# Altium project Altium101.PrjPcb (part 1 of 2)
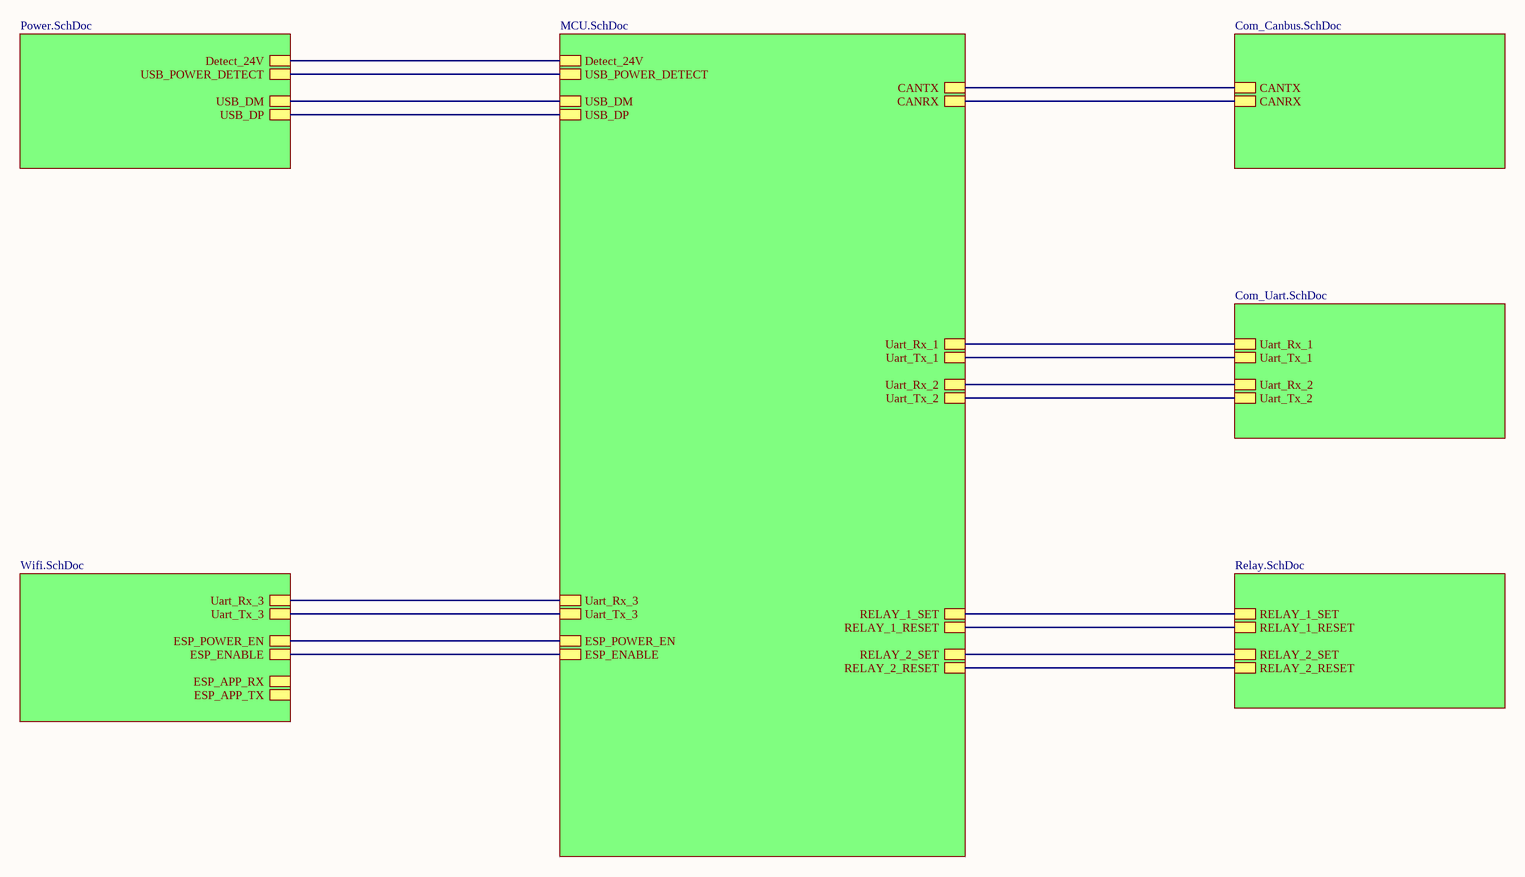
[diagram p0: Main.SchDoc]
7 sheets, 116 parts. Net scope: hierarchical (ports join the sheet entries above them; power ports are global).
Board file: Altium101.PcbDoc
Sheets:
  Main.SchDoc
    MCU = MCU.SchDoc
    Canbus = Com_Canbus.SchDoc
    Uart = Com_Uart.SchDoc
    Relay = Relay.SchDoc
    Wifi = Wifi.SchDoc
    Power = Power.SchDoc

## Sheet Main.SchDoc
size A3; CompanyName: Ok's Lab; Engineer: Oktay Topcu; SheetNumber: 1; SheetTotal: 7; UniqueID: 20200803; X1: Altium101.PrjPcb; X2: A3; X3: 20200803; X4: r1.0; X6: 1; X7: 7; X8: Main.SchDoc

### Sub-sheets
Canbus = Com_Canbus.SchDoc: CANTX, CANRX
MCU = MCU.SchDoc: RELAY_1_SET, RELAY_2_SET, RELAY_2_RESET, RELAY_1_RESET, Uart_Rx_1, Uart_Tx_1, Uart_Rx_2, Uart_Tx_2, Detect_24V, USB_DM, USB_DP, Uart_Rx_3, Uart_Tx_3, ESP_POWER_EN, ESP_ENABLE, CANRX, CANTX, USB_POWER_DETECT
Power = Power.SchDoc: Detect_24V, USB_DM, USB_DP, USB_POWER_DETECT
Relay = Relay.SchDoc: RELAY_1_RESET, RELAY_2_SET, RELAY_1_SET, RELAY_2_RESET
Uart = Com_Uart.SchDoc: Uart_Rx_1, Uart_Tx_1, Uart_Rx_2, Uart_Tx_2
Wifi = Wifi.SchDoc: Uart_Tx_3, Uart_Rx_3, ESP_POWER_EN, ESP_ENABLE, ESP_APP_RX, ESP_APP_TX

### Nets
CANRX: sheet MCU/CANRX, sheet Canbus/CANRX
CANTX: sheet MCU/CANTX, sheet Canbus/CANTX
Detect_24V: sheet MCU/Detect_24V, sheet Power/Detect_24V
ESP_ENABLE: sheet MCU/ESP_ENABLE, sheet Wifi/ESP_ENABLE
ESP_POWER_EN: sheet MCU/ESP_POWER_EN, sheet Wifi/ESP_POWER_EN
RELAY_1_RESET: sheet MCU/RELAY_1_RESET, sheet Relay/RELAY_1_RESET
RELAY_1_SET: sheet MCU/RELAY_1_SET, sheet Relay/RELAY_1_SET
RELAY_2_RESET: sheet MCU/RELAY_2_RESET, sheet Relay/RELAY_2_RESET
RELAY_2_SET: sheet MCU/RELAY_2_SET, sheet Relay/RELAY_2_SET
Uart_Rx_1: sheet MCU/Uart_Rx_1, sheet Uart/Uart_Rx_1
Uart_Rx_2: sheet MCU/Uart_Rx_2, sheet Uart/Uart_Rx_2
Uart_Rx_3: sheet MCU/Uart_Rx_3, sheet Wifi/Uart_Rx_3
Uart_Tx_1: sheet MCU/Uart_Tx_1, sheet Uart/Uart_Tx_1
Uart_Tx_2: sheet MCU/Uart_Tx_2, sheet Uart/Uart_Tx_2
Uart_Tx_3: sheet MCU/Uart_Tx_3, sheet Wifi/Uart_Tx_3
USB_DM: sheet MCU/USB_DM, sheet Power/USB_DM
USB_DP: sheet MCU/USB_DP, sheet Power/USB_DP
USB_POWER_DETECT: sheet MCU/USB_POWER_DETECT, sheet Power/USB_POWER_DETECT

### Notes on the sheet
- Title
- Size:
- Date:
- Number:
- Revision:
- Sheet
- of
- File:

## Sheet MCU.SchDoc
size A3; CompanyName: Ok's Lab; Engineer: Oktay Topcu; SheetNumber: 3; SheetTotal: 7; UniqueID: 20200803; X1: Altium101.PrjPcb; X2: A3; X3: 20200803; X4: r1.0; X6: 3; X7: 7; X8: MCU.SchDoc
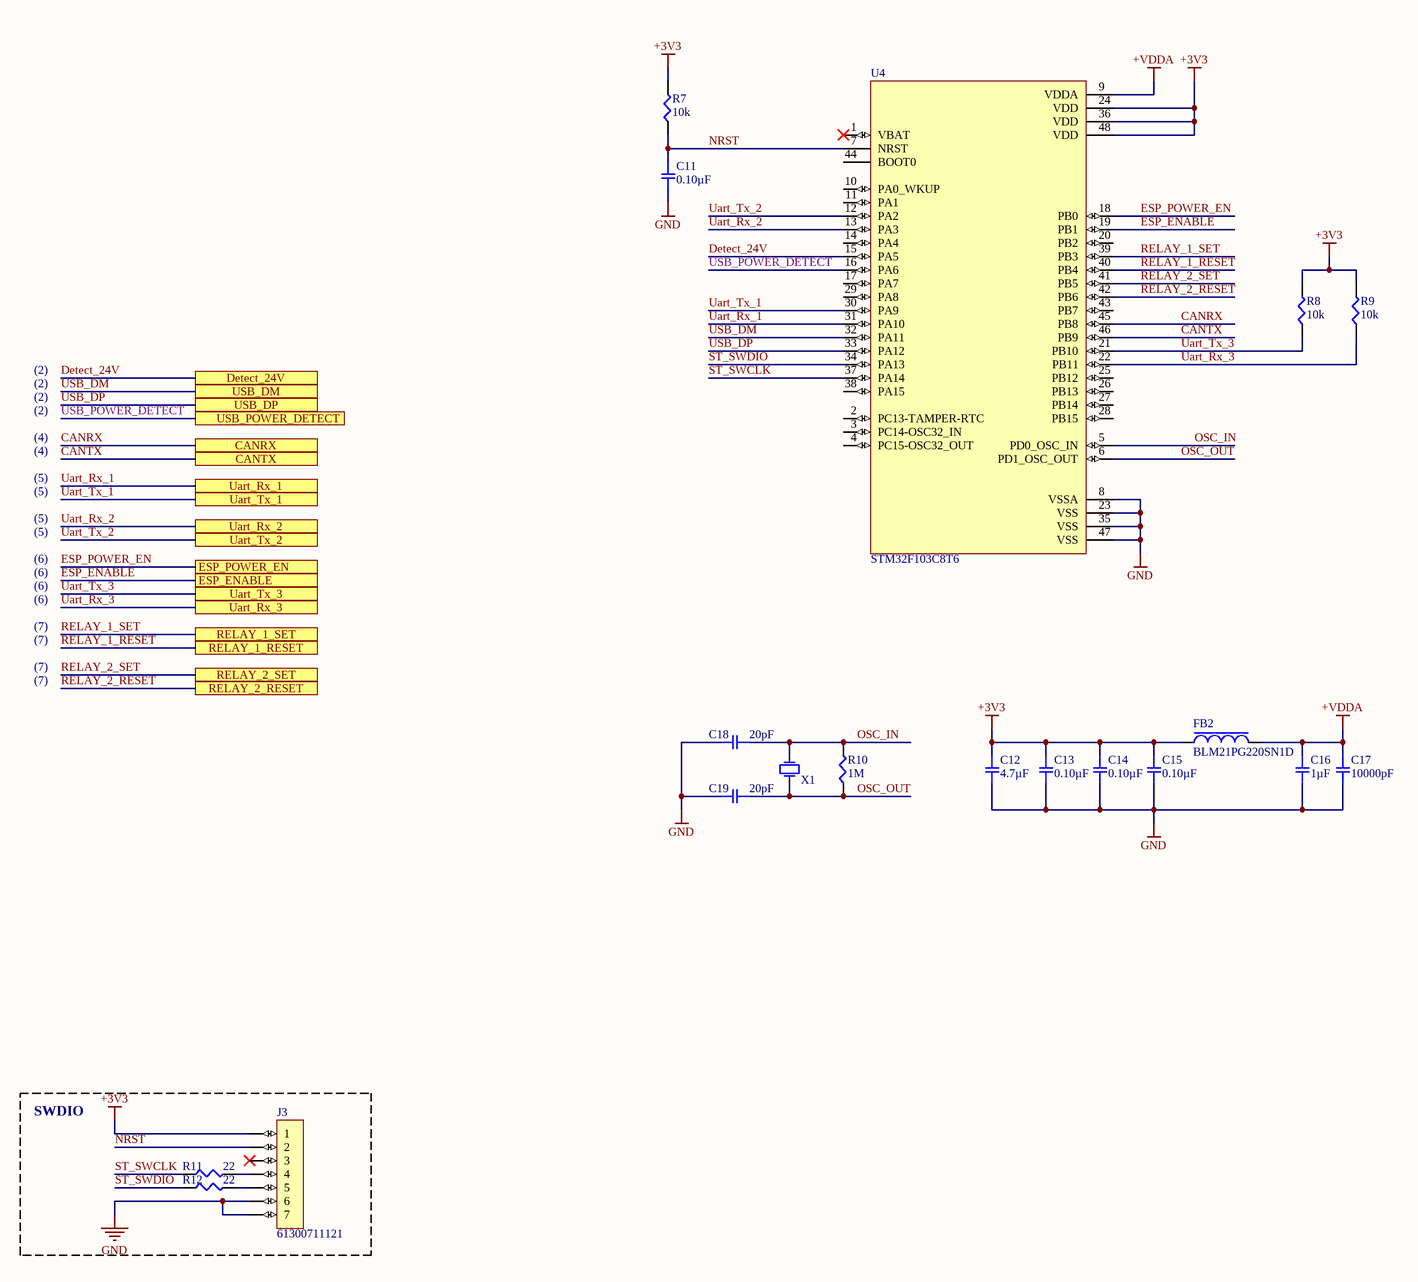
[diagram p1: MCU.SchDoc]

### Parts
C11  0.10µF  [SMD-0603C]
C12  4.7µF  [SMD-0805C]
C13  0.10µF  [SMD-0603C]
C14  0.10µF  [SMD-0603C]
C15  0.10µF  [SMD-0603C]
C16  1µF  [SMD-0603C]
C17  10000pF  [SMD-0603C]
C18  20pF  [SMD-0603C]
C19  20pF  [SMD-0603C]
FB2  BLM21PG220SN1D  [L-0805]
J3  61300711121  [HEADER_7__61300711121]
R7  10k  [SMD-0603-RES]
R8  10k  [SMD-0603-RES]
R9  10k  [SMD-0603-RES]
R10  1M  [SMD-0603-RES]
R11  22  [SMD-0603-RES]
R12  22  [SMD-0603-RES]
U4  STM32F103C8T6  [QFN48-(7mmX7mm)]
X1  EB3250AYA08-8.000M TR  [XTAL_3.2mm_1.5mm_2pad]  (value not drawn)

### Blocks framed on the sheet
SWDIO: J3 R11 R12

### Ports
CANRX, CANTX, Detect_24V, ESP_ENABLE, ESP_POWER_EN, RELAY_1_RESET, RELAY_1_SET, RELAY_2_RESET, RELAY_2_SET, Uart_Rx_1, Uart_Rx_2, Uart_Rx_3, Uart_Tx_1, Uart_Tx_2, Uart_Tx_3, USB_DM, USB_DP, USB_POWER_DETECT

### Nets
+3V3: C12.1 C13.1 C14.1 C15.1 FB2.1 J3.1 R7.2 R8.2 R9.2 U4.24(VDD) U4.36(VDD) U4.48(VDD)
+VDDA: C16.1 C17.1 FB2.2 U4.9(VDDA)
GND: C11.2 C12.2 C13.2 C14.2 C15.2 C16.2 C17.2 C18.2 C19.2 J3.6 J3.7 U4.8(VSSA) U4.23(VSS) U4.35(VSS) U4.47(VSS)
CANRX: U4.45(PB8) ; port CANRX
CANTX: U4.46(PB9) ; port CANTX
Detect_24V: U4.15(PA5) ; port Detect_24V
ESP_ENABLE: U4.19(PB1) ; port ESP_ENABLE
ESP_POWER_EN: U4.18(PB0) ; port ESP_POWER_EN
NRST: C11.1 J3.2 R7.1 U4.7(NRST)
OSC_IN: C18.1 R10.2 U4.5(PD0_OSC_IN) X1.2(OSC2)
OSC_OUT: C19.1 R10.1 U4.6(PD1_OSC_OUT) X1.1(OSC1)
RELAY_1_RESET: U4.40(PB4) ; port RELAY_1_RESET
RELAY_1_SET: U4.39(PB3) ; port RELAY_1_SET
RELAY_2_RESET: U4.42(PB6) ; port RELAY_2_RESET
RELAY_2_SET: U4.41(PB5) ; port RELAY_2_SET
ST_SWCLK: R11.1 U4.37(PA14)
ST_SWDIO: R12.1 U4.34(PA13)
Uart_Rx_1: U4.31(PA10) ; port Uart_Rx_1
Uart_Rx_2: U4.13(PA3) ; port Uart_Rx_2
Uart_Rx_3: R9.1 U4.22(PB11) ; port Uart_Rx_3
Uart_Tx_1: U4.30(PA9) ; port Uart_Tx_1
Uart_Tx_2: U4.12(PA2) ; port Uart_Tx_2
Uart_Tx_3: R8.1 U4.21(PB10) ; port Uart_Tx_3
USB_DM: U4.32(PA11) ; port USB_DM
USB_DP: U4.33(PA12) ; port USB_DP
USB_POWER_DETECT: U4.16(PA6) ; port USB_POWER_DETECT
NetJ3_4: J3.4 R11.2
NetJ3_5: J3.5 R12.2

Not connected (* = marked no-connect by the designer): J3 3*; U4 1(VBAT)* 2(PC13-TAMPER-RTC) 3(PC14-OSC32_IN) 4(PC15-OSC32_OUT) 10(PA0_WKUP) 11(PA1) 14(PA4) 17(PA7) 20(PB2) 25(PB12) 26(PB13) 27(PB14) 28(PB15) 29(PA8) 38(PA15) 43(PB7) 44(BOOT0)

### Notes on the sheet
- (2)
- (4)
- (5)
- (6)
- (7)
- Title
- Size:
- Date:
- Number:
- Revision:
- Sheet
- of
- File:

### Library data of the parts
C11 C13-C15 = GCJ188R71H104KA12D: CAP CER 0.1UF 50V X7R 0603; Manufacturer: Murata Electronics North America; Factory Stock: 0; Unit Price (USD): 0.12; Minimum Quantity: 1; Tolerance: ±10%; Datasheets: http://www.murata.com/~/media/webrenewal/support/library/catalog/products/capacitor/mlcc/c03e.ashx; Image: //media.digikey.com/Renders/Murata%20Renders/0603%28LQG18%29.jpg; Digi-Key Part Number: 490-5798-1-ND; Part Number: GCJ188R71H104KA12D; Quantity Available: 163695; @ qty: 0; Packaging: Cut Tape (CT); Series: GCJ; Part Status: Active; Value: 0.10µF; Voltage: 50V; Temperature Coefficient: X7R; Operating Temperature: -55°C ~ 125°C; Features: Soft Termination; Ratings: AEC-Q200; Applications: Automotive, Boardflex Sensitive; Mounting Type: Surface Mount, MLCC; Package / Case: 0603 (1608 Metric); Size / Dimension: 0.063" L x 0.031" W (1.60mm x 0.80mm); Height - Seated (Max): -; Thickness (Max): 0.035" (0.90mm); Lead Spacing: -; Lead Style: -
C12 = GCJ21BR71C475KA01L: CAP CER 4.7UF 16V X7R 0805; Manufacturer: Murata Electronics North America; Factory Stock: 0; Unit Price (USD): 0.44; Minimum Quantity: 1; Tolerance: ±10%; Datasheets: http://www.murata.com/~/media/webrenewal/support/library/catalog/products/capacitor/mlcc/c03e.ashx; Image: //media.digikey.com/Renders/Murata%20Renders/0805%20(2012%20Metric)%20.85mm.jpg; Digi-Key Part Number: 490-10557-1-ND; Part Number: GCJ21BR71C475KA01L; Quantity Available: 53217; @ qty: 0; Packaging: Cut Tape (CT); Series: GCJ; Part Status: Active; Value: 4.7µF; Voltage: 16V; Temperature Coefficient: X7R; Operating Temperature: -55°C ~ 125°C; Features: Soft Termination; Ratings: AEC-Q200; Applications: Automotive, Boardflex Sensitive; Mounting Type: Surface Mount, MLCC; Package / Case: 0805 (2012 Metric); Size / Dimension: 0.079" L x 0.049" W (2.00mm x 1.25mm); Height - Seated (Max): -; Thickness (Max): 0.057" (1.45mm); Lead Spacing: -; Lead Style: -
C16 = GCM188R71C105KA64D: CAP CER 1UF 16V X7R 0603; Manufacturer: Murata Electronics North America; Factory Stock: 0; Unit Price (USD): 0.24; Minimum Quantity: 1; Tolerance: ±10%; Datasheets: http://www.murata.com/~/media/webrenewal/support/library/catalog/products/capacitor/mlcc/c03e.ashx; Image: //media.digikey.com/Renders/Murata%20Renders/0603%28GCM188%29.jpg; Digi-Key Part Number: 490-5241-1-ND; Part Number: GCM188R71C105KA64D; Quantity Available: 9243; @ qty: 0; Packaging: Cut Tape (CT); Series: GCM; Part Status: Active; Value: 1µF; Voltage: 16V; Temperature Coefficient: X7R; Operating Temperature: -55°C ~ 125°C; Features: -; Ratings: AEC-Q200; Applications: Automotive; Mounting Type: Surface Mount, MLCC; Package / Case: 0603 (1608 Metric); Size / Dimension: 0.063" L x 0.031" W (1.60mm x 0.80mm); Height - Seated (Max): -; Thickness (Max): 0.035" (0.90mm); Lead Spacing: -; Lead Style: -
C17 = GRM188R71C103KA01D: CAP CER 10000PF 16V X7R 0603; Manufacturer: Murata Electronics North America; Factory Stock: 0; Unit Price (USD): 0.1; Minimum Quantity: 1; Tolerance: ±10%; Datasheets: http://www.murata.com/~/media/webrenewal/support/library/catalog/products/capacitor/mlcc/c02e.pdf; Image: //media.digikey.com/Renders/Murata%20Renders/ZRB-SERIES-0402.jpg; Digi-Key Part Number: 490-1525-1-ND; Part Number: GRM188R71C103KA01D; Quantity Available: 178769; @ qty: 0; Packaging: Cut Tape (CT); Series: GRM; Part Status: Active; Value: 10000pF; Voltage: 16V; Temperature Coefficient: X7R; Operating Temperature: -55°C ~ 125°C; Features: -; Ratings: -; Applications: General Purpose; Mounting Type: Surface Mount, MLCC; Package / Case: 0603 (1608 Metric); Size / Dimension: 0.063" L x 0.031" W (1.60mm x 0.80mm); Height - Seated (Max): -; Thickness (Max): 0.035" (0.90mm); Lead Spacing: -; Lead Style: -
C18 C19 = GCM1885C1H200JA16D: CAP CER 20PF 50V NP0 0603; Manufacturer: Murata Electronics North America; Factory Stock: 0; Unit Price (USD): 0.11; Minimum Quantity: 1; Tolerance: ±5%; Temperature Coefficient: C0G, NP0; Datasheets: http://www.murata.com/~/media/webrenewal/support/library/catalog/products/capacitor/mlcc/c03e.ashx; Image: //media.digikey.com/Renders/Murata%20Renders/0603%28GCM188%29.jpg; Digi-Key Part Number: 490-13299-1-ND; Part Number: GCM1885C1H200JA16D; Quantity Available: 4211; @ qty: 0; Packaging: Cut Tape (CT); Series: GCM; Part Status: Active; Value: 20pF; Voltage: 50V; Operating Temperature: -55°C ~ 125°C; Features: -; Ratings: AEC-Q200; Applications: Automotive; Mounting Type: Surface Mount, MLCC; Package / Case: 0603 (1608 Metric); Size / Dimension: 0.063" L x 0.031" W (1.60mm x 0.80mm); Height - Seated (Max): -; Thickness (Max): 0.035" (0.90mm); Lead Spacing: -; Lead Style: -
FB2 = Ferrite_Bead__BLM21PG220SN1D: FERRITE BEAD 22 OHM 0805 1LN; Manufacturer: Murata; Manufacturer Series: BLM21P; Material: Steel,Ferrite; Impedance: 22R; DC Resistance (DCR): 9mR; Tolerance: 25%; Current Rating: 6A; Shielding: Unshielded; Number of Circuits: 1; Resistance: 10mR; Test Frequency: 100MHz; Supplier 1: Avnet; Manufacturer Part Number: BLM21PG220SN1D; Stock 1: 0; Pricing 1: 4000=0.0273, 8000=0.0267, 16000=0.0263, 24000=0.0256, 32000=0.025 (USD); Case/Package: 0805; Number of Pins: 2; Core Material: Ferrite; Case Code (Metric): 2012; Case Code (Imperial): 0805; Weight: 0.000194oz; Terminal Finish: Tin; Min Operating Temperature: -55°C; Max Operating Temperature: 125°C; Packaging: Tape and Reel; Max DC Current: 6A; Number of Lines: 1; Series: BLM21P; Package Quantity: 1; Max Current Rating: 6A; Termination: SMD/SMT; DC Current: 6A; DC Resistance-Max: 9mR; Number of Functions: 1; Length: 2mm; Width: 1.25mm; Height: 0.85mm; Depth: 1.25mm; Radiation Hardening: No; REACH SVHC: No SVHC; Lead Free: Lead Free; RoHS Compliant: Yes; ComponentLink1URL: http://www.murata.com/products/catalog/pdf/c31e.pdf?src-supplier=Element14; ComponentLink1Description: http://www.murata.com/products/catalog/pdf/c31e.pdf?src-supplier=Element14; ComponentLink2URL: http://www.murata.com/products/catalog/pdf/c31e.pdf?src-supplier=Distrelec; ComponentLink2Description: http://www.murata.com/products/catalog/pdf/c31e.pdf?src-supplier=Distrelec; ComponentLink3URL: http://www.jameco.com/Jameco/Products/ProdDS/1845312.pdf?src-supplier=Jameco; ComponentLink3Description: http://www.jameco.com/Jameco/Products/ProdDS/1845312.pdf?src-supplier=Jameco; ComponentLink4URL: https://www.murata.com/en-us/products/productdata/8796738977822/ENFA0005.pdf?src-supplier=Digi-Key; ComponentLink4Description: https://www.murata.com/en-us/products/productdata/8796738977822/ENFA0005.pdf?src-supplier=Digi-Key; ComponentLink5URL: http://uk.rs-online.com/webdocs/13ec/0900766b813ecf58.pdf?src-supplier=RSComponents; ComponentLink5Description: http://uk.rs-online.com/webdocs/13ec/0900766b813ecf58.pdf?src-supplier=RSComponents; ComponentLink6URL: http://www.murata.com/products/catalog/pdf/c31e.pdf?src-supplier=Avnet; ComponentLink6Description: http://www.murata.com/products/catalog/pdf/c31e.pdf?src-supplier=Avnet; ComponentLink7URL: http://search.murata.co.jp/Ceramy/image/img/PDF/ENG/L0110S0100BLM21P.pdf?src-supplier=Future+Electronics; ComponentLink7Description: http://search.murata.co.jp/Ceramy/image/img/PDF/ENG/L0110S0100BLM21P.pdf?src-supplier=Future+Electronics; ComponentLink8URL: http://www.produktinfo.conrad.com/datenblaetter/1100000-1199999/001171738-da-01-en-CHIP_DROSSEL0805_22R0_6000MA_2_0X1_25MM.pdf?src-supplier=Conrad; ComponentLink8Description: http://www.produktinfo.conrad.com/datenblaetter/1100000-1199999/001171738-da-01-en-CHIP_DROSSEL0805_22R0_6000MA_2_0X1_25MM.pdf?src-supplier=Conrad; Supplier Part Number 1: BLM21PG220SN1D
J3 = HEADER_7__61300711121: CONN HEADER 7 POS 2.54; Manufacturer: Wurth Electronics Inc.; Current Rating: 3A; Voltage Rating: 250V; Material Flammability Rating: UL94 V-0; Style: Board to Board or Cable; Number of Positions Loaded: All; Overall Contact Length: 0.454" (11.54mm); Number of Positions: 7; Contact Length - Mating: 0.236" (6.00mm); Contact Length - Post: 0.118" (3.00mm); Shrouding: Unshrouded; Pitch - Mating: 0.100" (2.54mm); Contact Shape: Square; Insulation Height: 0.100" (2.54mm); Insulation Color: Black; Contact Finish Thickness - Mating: -; Operating Temperature: -40°C ~ 125°C; Contact Material: Copper Alloy; Features: -; Ingress Protection: -; Contact Finish - Post: -; Mated Stacking Heights: -; Contact Finish - Mating: Gold; Applications: -; Contact Finish Thickness - Post: -; Insulation Material: Polybutylene Terephthalate (PBT); Manufacturer Part Number: 61300711121; Fastening Type: Push-Pull; Supplier: Digi-Key; Category: Connectors, Interconnects; Mounting Type: Through Hole; Row Spacing - Mating: -; Connector Type: Header; Number of Rows: 1; Termination: Solder; RoHS: RoHS Compliant; Packaging: Bulk; Contact Type: Male Pin; Part Status: Active; ComponentLink1URL: http://katalog.we-online.de/em/datasheet/6130xx11121.pdf; ComponentLink1Description: http://katalog.we-online.de/em/datasheet/6130xx11121.pdf; Pricing: 1=0.37, 10=0.315, 25=0.2632, 50=0.219, 100=0.199, 1000=0.181 (USD); Supplier Part Number: 732-5320-ND
R7 = ERJ-3GEYJ103V: RES SMD 10K OHM 5% 1/10W 0603; Manufacturer: Panasonic Electronic Components; Factory Stock: 0; Unit Price (USD): 0.00321; @ qty: 1500; Minimum Quantity: 1; Power (Watts): 0.1W, 1/10W; Temperature Coefficient: ±200ppm/°C; Part Number: ERJ-3GEYJ103V; Datasheets: http://industrial.panasonic.com/www-cgi/jvcr13pz.cgi?E+PZ+3+AOA0001+ERJ3GEYJ103V+7+WW; Image: //media.digikey.com/Photos/Panasonic%20Photos/MFG_ERJ-P6W%20Series.jpg; Digi-Key Part Number: P10KGCT-ND; Quantity Available: 7178118; Packaging: Cut Tape (CT); Series: ERJ; Part Status: Active; Value: 10k; Tolerance: ±5%; Composition: Thick Film; Features: Automotive AEC-Q200; Operating Temperature: -55°C ~ 155°C; Package / Case: 0603 (1608 Metric); Supplier Device Package: 0603; Size / Dimension: 0.063" L x 0.031" W (1.60mm x 0.80mm); Height - Seated (Max): 0.022" (0.55mm); Number of Terminations: 2; Failure Rate: -
R8 R9 = ERJ-3EKF1002V: RES SMD 10K OHM 1% 1/10W 0603; Manufacturer: Panasonic Electronic Components; Factory Stock: 0; Unit Price (USD): 0.00379; @ qty: 1500; Minimum Quantity: 1; Power (Watts): 0.1W, 1/10W; Temperature Coefficient: ±100ppm/°C; Part Number: ERJ-3EKF1002V; Datasheets: http://industrial.panasonic.com/www-cgi/jvcr13pz.cgi?E+PZ+3+AOA0002+ERJ3EKF1002V+7+WW; Image: //media.digikey.com/Photos/Panasonic%20Photos/MFG_ERJ-P6W%20Series.jpg; Digi-Key Part Number: P10.0KHCT-ND; Quantity Available: 6703141; Packaging: Cut Tape (CT); Series: ERJ; Part Status: Active; Value: 10k; Tolerance: ±1%; Composition: Thick Film; Features: Automotive AEC-Q200; Operating Temperature: -55°C ~ 155°C; Package / Case: 0603 (1608 Metric); Supplier Device Package: 0603; Size / Dimension: 0.063" L x 0.031" W (1.60mm x 0.80mm); Height - Seated (Max): 0.022" (0.55mm); Number of Terminations: 2; Failure Rate: -
R10 = ERJ-3GEYJ105V: RES SMD 1M OHM 5% 1/10W 0603; Manufacturer: Panasonic Electronic Components; Factory Stock: 0; Unit Price (USD): 0.00321; @ qty: 1500; Minimum Quantity: 1; Power (Watts): 0.1W, 1/10W; Temperature Coefficient: ±200ppm/°C; Part Number: ERJ-3GEYJ105V; Datasheets: http://industrial.panasonic.com/www-cgi/jvcr13pz.cgi?E+PZ+3+AOA0001+ERJ3GEYJ105V+7+WW; Image: //media.digikey.com/Photos/Panasonic%20Photos/MFG_ERJ-P6W%20Series.jpg; Digi-Key Part Number: P1.0MGCT-ND; Quantity Available: 250051; Packaging: Cut Tape (CT); Series: ERJ; Part Status: Active; Value: 1M; Tolerance: ±5%; Composition: Thick Film; Features: Automotive AEC-Q200; Operating Temperature: -55°C ~ 155°C; Package / Case: 0603 (1608 Metric); Supplier Device Package: 0603; Size / Dimension: 0.063" L x 0.031" W (1.60mm x 0.80mm); Height - Seated (Max): 0.022" (0.55mm); Number of Terminations: 2; Failure Rate: -
R11 R12 = ERJ-3EKF22R0V: RES SMD 22 OHM 1% 1/10W 0603; Manufacturer: Panasonic Electronic Components; Factory Stock: 0; Unit Price (USD): 0.00379; @ qty: 1500; Minimum Quantity: 1; Power (Watts): 0.1W, 1/10W; Temperature Coefficient: ±100ppm/°C; Part Number: ERJ-3EKF22R0V; Datasheets: http://industrial.panasonic.com/www-cgi/jvcr13pz.cgi?E+PZ+3+AOA0002+ERJ3EKF22R0V+7+WW; Image: //media.digikey.com/Photos/Panasonic%20Photos/MFG_ERJ-P6W%20Series.jpg; Digi-Key Part Number: P22.0HCT-ND; Quantity Available: 100321; Packaging: Cut Tape (CT); Series: ERJ; Part Status: Active; Value: 22; Tolerance: ±1%; Composition: Thick Film; Features: Automotive AEC-Q200; Operating Temperature: -55°C ~ 155°C; Package / Case: 0603 (1608 Metric); Supplier Device Package: 0603; Size / Dimension: 0.063" L x 0.031" W (1.60mm x 0.80mm); Height - Seated (Max): 0.022" (0.55mm); Number of Terminations: 2; Failure Rate: -
U4 = STM32F103C8T6: IC MCU 32-Bit 72MHz 64kB FLASH LQFP48; MF: STMicroelectronics; RAM Size: 20KB; Max Power Dissipation: 363mW; Interface: I2C,SPI,USB,CAN,IrDA,UART,USART,LIN; Number of I/Os: 37; Number of Timers/Counters: 4; Max Supply Voltage: 3.6V; Number of ADC Channels: 10; Min Supply Voltage: 2V; Oscillator Type: Internal; Number of Programmable I/O: 48; Data Bus Width: 32b; Number of Bits: 32; Watchdog Timer: Yes; Peripherals: POR,PWM,WDT,DMA,Temp Sensor,I2C; Core Architecture: ARM; Number of PWM Channels: 1; Number of SPI Channels: 2; Price: None; Package: LQFP-48 STMicroelectronics; Value: *; MP: STM32F103C8T6; Availability: Unavailable; Supplier 1: Digi-Key; Manufacturer: STMicroelectronics; Manufacturer Part Number: STM32F103C8T6; RoHS: Yes; Category: Microcontrollers; Pricing 1: 1=7,00000, 10=6,28800, 25=5,94440, 80=5,15175, 250=4,88756, 500=4,40320 (USD); Case/Package: LQFP; Number of Pins: 48; Min Operating Temperature: -40°C; Max Operating Temperature: 85°C; Frequency: 72MHz; Packaging: Tray; Package Quantity: 250; Density: 64KB; Memory Type: FLASH; Max Frequency: 72MHz; Memory Size: 64KB; Termination: SMD/SMT; Number of I2C Channels: 2; Address Bus Width: 32b; Length: 7mm; Width: 7.2mm; Height: 1.45mm; Radiation Hardening: No; Lead Free: Lead Free; REACH SVHC: No SVHC; ComponentLink1URL: https://datasheet.ciiva.com/15122/getdatasheetpartid-69880-15122076.pdf?src-supplier=Verical; ComponentLink1Description: https://datasheet.ciiva.com/15122/getdatasheetpartid-69880-15122076.pdf?src-supplier=Verical; ComponentLink2URL: https://datasheet.ciiva.com/26816/stm32f103c8t6-26816902.pdf?src-supplier=IIIC; ComponentLink2Description: https://datasheet.ciiva.com/26816/stm32f103c8t6-26816902.pdf?src-supplier=IIIC; ComponentLink3URL: https://datasheet.ciiva.com/16210/cd00161566-16210248.pdf?src-supplier=Future+Electronics; ComponentLink3Description: https://datasheet.ciiva.com/16210/cd00161566-16210248.pdf?src-supplier=Future+Electronics; ComponentLink4URL: https://datasheet.ciiva.com/14100/pustm-arm-microcont-stm32f103-en-14100508.pdf?src-supplier=Distrelec; ComponentLink4Description: https://datasheet.ciiva.com/14100/pustm-arm-microcont-stm32f103-en-14100508.pdf?src-supplier=Distrelec; ComponentLink5URL: https://datasheet.ciiva.com/8054/1730126-8054942.pdf?src-supplier=Element14; ComponentLink5Description: https://datasheet.ciiva.com/8054/1730126-8054942.pdf?src-supplier=Element14; ComponentLink6URL: https://datasheet.ciiva.com/48687/001075658-da-01-en-mcu-64kb-mem-stm32f103c8t6-lqfp-48-stm-48687589.pdf?src-supplier=Conrad; ComponentLink6Description: https://datasheet.ciiva.com/48687/001075658-da-01-en-mcu-64kb-mem-stm32f103c8t6-lqfp-48-stm-48687589.pdf?src-supplier=Conrad; Supplier Part Number 1: 497-6063-ND
X1 = CRYSTAL__ECS-.327-12.5-34B-TR: Crystal 8MHz 8pF Automotive 2-Pin CSMD T/R; Manufacturer: Ecliptek; Supplier 1: Digi-Key; Supplier Part Number 1: 2773-EB3250AYA08-8.000MCT-ND; Manufacturer Part Number: EB3250AYA08-8.000M TR; RoHS: Yes; Stock 1: 16756; Pricing 1: 1=1,05000, 10=0,92900, 50=0,86860, 100=0,76760, 500=0,72720 (USD); RoHS Compliant: No

## Sheet Com_Canbus.SchDoc
size A3; CompanyName: Ok's Lab; Engineer: Oktay Topcu; SheetNumber: 4; SheetTotal: 7; UniqueID: 20200803; X1: Altium101.PrjPcb; X2: A3; X3: 20200803; X4: r1.0; X6: 4; X7: 7; X8: Com_Canbus.SchDoc
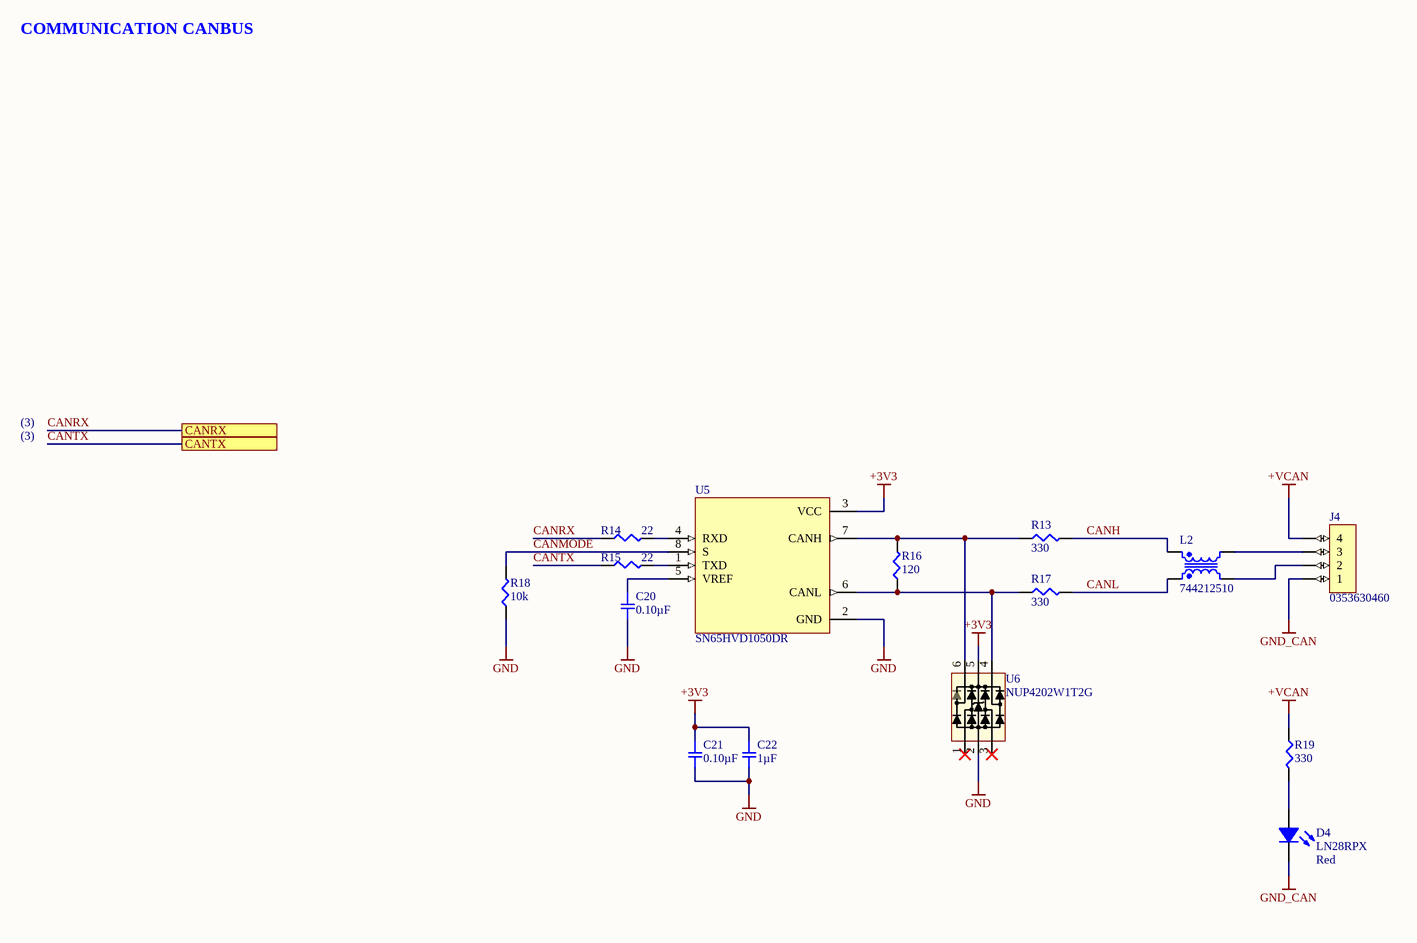
[diagram p2: Com_Canbus.SchDoc]

### Parts
C20  0.10µF  [SMD-0603C]
C21  0.10µF  [SMD-0603C]
C22  1µF  [SMD-0603C]
D4  LN28RPX  Lens Color: Red  [Led-3mm-Red-h7]
J4  0353630460  [CONN_4_POS__0353630460]
L2  744212510  [CM_6.50mm x 3.60mm]
R13  330  [SMD-0603-RES]
R14  22  [SMD-0603-RES]
R15  22  [SMD-0603-RES]
R16  120  [SMD-0603-RES]
R17  330  [SMD-0603-RES]
R18  10k  [SMD-0603-RES]
R19  330  [SMD-0603-RES]
U5  SN65HVD1050DR  [SOIC-8_L]
U6  NUP4202W1T2G  [SOT-363]

### Ports
CANRX, CANTX

### Nets
+3V3: C21.1 C22.1 U5.3(VCC) U6.5
+VCAN: J4.4 R19.1
GND: C20.2 C21.2 C22.2 R18.1 U5.2(GND) U6.2
GND_CAN: D4.2(K) J4.1
CANH: L2.3 R13.2
CANL: L2.1 R17.2
CANMODE: R18.2 U5.8(S)
CANRX: R14.1 ; port CANRX
CANTX: R15.1 ; port CANTX
NetC20_1: C20.1 U5.5(VREF)
NetD4_1: D4.1(A) R19.2
NetJ4_2: J4.2 L2.5
NetJ4_3: J4.3 L2.4
NetR13_1: R13.1 R16.2 U5.7(CANH) U6.6
NetR14_2: R14.2 U5.4(RXD)
NetR15_2: R15.2 U5.1(TXD)
NetR16_1: R16.1 R17.1 U5.6(CANL) U6.4

Not connected (* = marked no-connect by the designer): U6 1* 3*

### Notes on the sheet
- COMMUNICATION CANBUS
- (3)
- Title
- Size:
- Date:
- Number:
- Revision:
- Sheet
- of
- File:

### Library data of the parts
C20 C21 = GCJ188R71H104KA12D: as C11 on sheet MCU; Datasheets: http://www.murata.com/~/media/webrenewal/support/library/catalog/products/capacitor/mlcc/c03e.ashx; Image: //media.digikey.com/Renders/Murata%20Renders/0603%28LQG18%29.jpg; Digi-Key Part Number: 490-5798-1-ND; Part Number: GCJ188R71H104KA12D; Quantity Available: 163695; @ qty: 0; Packaging: Cut Tape (CT); Series: GCJ; Part Status: Active; Value: 0.10µF; Voltage: 50V; Temperature Coefficient: X7R; Operating Temperature: -55°C ~ 125°C; Features: Soft Termination; Ratings: AEC-Q200; Applications: Automotive, Boardflex Sensitive; Mounting Type: Surface Mount, MLCC; Package / Case: 0603 (1608 Metric); Size / Dimension: 0.063" L x 0.031" W (1.60mm x 0.80mm); Height - Seated (Max): -; Thickness (Max): 0.035" (0.90mm); Lead Spacing: -; Lead Style: -
C22 = GCM188R71C105KA64D: as C16 on sheet MCU; Datasheets: http://www.murata.com/~/media/webrenewal/support/library/catalog/products/capacitor/mlcc/c03e.ashx; Image: //media.digikey.com/Renders/Murata%20Renders/0603%28GCM188%29.jpg; Digi-Key Part Number: 490-5241-1-ND; Part Number: GCM188R71C105KA64D; Quantity Available: 9243; @ qty: 0; Packaging: Cut Tape (CT); Series: GCM; Part Status: Active; Value: 1µF; Voltage: 16V; Temperature Coefficient: X7R; Operating Temperature: -55°C ~ 125°C; Features: -; Ratings: AEC-Q200; Applications: Automotive; Mounting Type: Surface Mount, MLCC; Package / Case: 0603 (1608 Metric); Size / Dimension: 0.063" L x 0.031" W (1.60mm x 0.80mm); Height - Seated (Max): -; Thickness (Max): 0.035" (0.90mm); Lead Spacing: -; Lead Style: -
D4 = LED_RED__LN28RPX: LED RED DIFF 3MM ROUND T/H; Manufacturer: Panasonic Electronic Components; Lens Transparency: Diffused; Millicandela Rating: 2.8mcd; Lens Style/Size: Round with Domed Top, 3mm (T-1), 3.00mm; Voltage - Forward (Vf) (Typ): 2.2V; Current - Test: 15mA; Wavelength - Peak: 700nm; Manufacturer Part Number: LN28RPX; Category: Optoelectronics; Supplier: Digi-Key; RoHS: RoHS Compliant; Packaging: Bulk; Part Status: Not For New Designs; Color: Red; Viewing Angle: -; Mounting Type: Through Hole; Wavelength - Dominant: -; Features: -; Package / Case: Radial; Supplier Device Package: 3mm Round; Size / Dimension: -; Height (Max): 5.70mm; ComponentLink1URL: http://industrial.panasonic.com/www-cgi/jvcr13pz.cgi?E+SC+4+ATA7001+LN28RPX+8+WW; ComponentLink1Description: http://industrial.panasonic.com/www-cgi/jvcr13pz.cgi?E+SC+4+ATA7001+LN28RPX+8+WW; Pricing: 1=0.45, 10=0.326, 25=0.2664, 100=0.213, 250=0.17972, 500=0.15308, 1000=0.11981, 2500=0.10982, 5000=0.09984 (USD); Supplier Part Number: P563-ND
J4 = CONN_4_POS__0353630460: CONN HEADER 4POS 2MM R/A TIN; Manufacturer: Molex Connector Corporation; Shrouding: Shrouded - 4 Wall; Style: Board to Cable/Wire; Pitch - Mating: 0.079" (2.00mm); Material Flammability Rating: UL94 V-0; Contact Length - Mating: 0.145" (3.70mm); Contact Length - Post: 0.126" (3.20mm); Number of Positions Loaded: All; Number of Positions: 4; Insulation Color: Natural; Insulation Material: Polyamide (PA), Nylon; Contact Finish Thickness - Mating: 78.7µin (2.00µm); Insulation Height: 0.217" (5.51mm); Overall Contact Length: -; Part Status: Active; Current Rating: -; RoHS: RoHS Compliant; Ingress Protection: -; Contact Material: Brass; Contact Finish - Post: Tin; Termination: Kinked Pin, Solder; Mounting Type: Through Hole, Right Angle; Fastening Type: Locking Ramp; Row Spacing - Mating: -; Mated Stacking Heights: -; Features: -; Contact Shape: Square; Contact Type: Male Pin; Packaging: Bulk; Supplier: Digi-Key; Manufacturer Part Number: 0353630460; Category: Connectors, Interconnects; Contact Finish Thickness - Post: 78.7µin (2.00µm); Voltage Rating: -; Operating Temperature: -; Contact Finish - Mating: Tin; Number of Rows: 1; Connector Type: Header; Applications: Automotive, General Purpose; ComponentLink1URL: http://www.molex.com/pdm_docs/sd/353630460_sd.pdf; ComponentLink1Description: http://www.molex.com/pdm_docs/sd/353630460_sd.pdf; Pricing: 1=0.48, 10=0.455, 100=0.3184, 500=0.27294, 1000=0.22745, 5000=0.19496, 10000=0.18196 (USD); Supplier Part Number: WM18933-ND
L2 = CM__744212510: Common Mode Filters / Chokes WE-SL1 SMD Ln Filter 2x51uH 300ohm; Manufacturer: Wurth Electronics; Core Material: Ferrite; Inductance: 51uH; Number of Lines: 2; DC Resistance (DCR): 160mR; Current Rating: 300mA; Test Frequency: 100kHz; Inductance Tolerance: 50%; Voltage Rating (DC): 80V; Impedance: 300R; Supplier 1: Digi-Key; Manufacturer Part Number: 744212510; RoHS: Yes; Category: Fixed Inductors; Pricing 1: 1=4,37000, 10=4,31200, 50=3,89500, 100=3,75600, 500=3,47800 (USD); Mount: Surface Mount; Case/Package: SMD/SMT; Number of Pins: 4; Min Operating Temperature: -40°C; Max Operating Temperature: 105°C; Package Quantity: 1000; Packaging: Tape and Reel; Current: 300mA; Max DC Current: 300mA; Termination: SMD/SMT; Series: WE-SL1; Tolerance: 50%; Length: 6.5mm; Width: 0.142inch; Height: 1.65mm; Depth: 3.6mm; REACH SVHC: No SVHC; Lead Free: Lead Free; RoHS Compliant: Yes; ComponentLink1URL: https://datasheet.ciiva.com/11800/0900766b8059564e-11800467.pdf?src-supplier=RSComponents; ComponentLink1Description: https://datasheet.ciiva.com/11800/0900766b8059564e-11800467.pdf?src-supplier=RSComponents; ComponentLink2URL: https://datasheet.ciiva.com/6048/1735560-6048484.pdf?src-supplier=Farnell; ComponentLink2Description: https://datasheet.ciiva.com/6048/1735560-6048484.pdf?src-supplier=Farnell; ComponentLink3URL: https://datasheet.ciiva.com/1130/744212510-1130407.pdf?src-supplier=Newark; ComponentLink3Description: https://datasheet.ciiva.com/1130/744212510-1130407.pdf?src-supplier=Newark; ComponentLink4URL: https://datasheet.ciiva.com/4952/744212510-77598-4952687.pdf?src-supplier=Mouser; ComponentLink4Description: https://datasheet.ciiva.com/4952/744212510-77598-4952687.pdf?src-supplier=Mouser; ComponentLink5URL: https://datasheet.ciiva.com/7764/1735560-7764951.pdf?src-supplier=Element14; ComponentLink5Description: https://datasheet.ciiva.com/7764/1735560-7764951.pdf?src-supplier=Element14; ComponentLink6URL: https://datasheet.ciiva.com/6216/744212510-6216346.pdf?src-supplier=Digi-Key; ComponentLink6Description: https://datasheet.ciiva.com/6216/744212510-6216346.pdf?src-supplier=Digi-Key; ComponentLink7URL: https://datasheet.ciiva.com/22705/1735560-22705131.pdf?src-supplier=Element14; ComponentLink7Description: https://datasheet.ciiva.com/22705/1735560-22705131.pdf?src-supplier=Element14; ComponentLink8URL: https://datasheet.ciiva.com/6216/744212510-6216348.pdf?src-supplier=Digi-Key; ComponentLink8Description: https://datasheet.ciiva.com/6216/744212510-6216348.pdf?src-supplier=Digi-Key; Supplier Part Number 1: 732-3941-6-ND
R13 R17 R19 = ERJ-3EKF3300V: RES SMD 330 OHM 1% 1/10W 0603; Manufacturer: Panasonic Electronic Components; Factory Stock: 0; Unit Price (USD): 0.00379; @ qty: 1500; Minimum Quantity: 1; Power (Watts): 0.1W, 1/10W; Temperature Coefficient: ±100ppm/°C; Part Number: ERJ-3EKF3300V; Datasheets: http://industrial.panasonic.com/www-cgi/jvcr13pz.cgi?E+PZ+3+AOA0002+ERJ3EKF3300V+7+WW; Image: //media.digikey.com/Photos/Panasonic%20Photos/MFG_ERJ-P6W%20Series.jpg; Digi-Key Part Number: P330HCT-ND; Quantity Available: 670984; Packaging: Cut Tape (CT); Series: ERJ; Part Status: Active; Value: 330; Tolerance: ±1%; Composition: Thick Film; Features: Automotive AEC-Q200; Operating Temperature: -55°C ~ 155°C; Package / Case: 0603 (1608 Metric); Supplier Device Package: 0603; Size / Dimension: 0.063" L x 0.031" W (1.60mm x 0.80mm); Height - Seated (Max): 0.022" (0.55mm); Number of Terminations: 2; Failure Rate: -
R14 R15 = ERJ-3EKF22R0V: as R11 on sheet MCU; Part Number: ERJ-3EKF22R0V; Datasheets: http://industrial.panasonic.com/www-cgi/jvcr13pz.cgi?E+PZ+3+AOA0002+ERJ3EKF22R0V+7+WW; Image: //media.digikey.com/Photos/Panasonic%20Photos/MFG_ERJ-P6W%20Series.jpg; Digi-Key Part Number: P22.0HCT-ND; Quantity Available: 100321; Packaging: Cut Tape (CT); Series: ERJ; Part Status: Active; Value: 22; Tolerance: ±1%; Composition: Thick Film; Features: Automotive AEC-Q200; Operating Temperature: -55°C ~ 155°C; Package / Case: 0603 (1608 Metric); Supplier Device Package: 0603; Size / Dimension: 0.063" L x 0.031" W (1.60mm x 0.80mm); Height - Seated (Max): 0.022" (0.55mm); Number of Terminations: 2; Failure Rate: -
R16 = ERJ-3EKF1200V: RES SMD 120 OHM 1% 1/10W 0603; Manufacturer: Panasonic Electronic Components; Factory Stock: 0; Unit Price (USD): 0.00379; @ qty: 1500; Minimum Quantity: 1; Power (Watts): 0.1W, 1/10W; Temperature Coefficient: ±100ppm/°C; Part Number: ERJ-3EKF1200V; Datasheets: http://industrial.panasonic.com/www-cgi/jvcr13pz.cgi?E+PZ+3+AOA0002+ERJ3EKF1200V+7+WW; Image: //media.digikey.com/Photos/Panasonic%20Photos/MFG_ERJ-P6W%20Series.jpg; Digi-Key Part Number: P120HCT-ND; Quantity Available: 84623; Packaging: Cut Tape (CT); Series: ERJ; Part Status: Active; Value: 120; Tolerance: ±1%; Composition: Thick Film; Features: Automotive AEC-Q200; Operating Temperature: -55°C ~ 155°C; Package / Case: 0603 (1608 Metric); Supplier Device Package: 0603; Size / Dimension: 0.063" L x 0.031" W (1.60mm x 0.80mm); Height - Seated (Max): 0.022" (0.55mm); Number of Terminations: 2; Failure Rate: -
R18 = ERJ-3EKF1002V: as R8 on sheet MCU; Part Number: ERJ-3EKF1002V; Datasheets: http://industrial.panasonic.com/www-cgi/jvcr13pz.cgi?E+PZ+3+AOA0002+ERJ3EKF1002V+7+WW; Image: //media.digikey.com/Photos/Panasonic%20Photos/MFG_ERJ-P6W%20Series.jpg; Digi-Key Part Number: P10.0KHCT-ND; Quantity Available: 6703141; Packaging: Cut Tape (CT); Series: ERJ; Part Status: Active; Value: 10k; Tolerance: ±1%; Composition: Thick Film; Features: Automotive AEC-Q200; Operating Temperature: -55°C ~ 155°C; Package / Case: 0603 (1608 Metric); Supplier Device Package: 0603; Size / Dimension: 0.063" L x 0.031" W (1.60mm x 0.80mm); Height - Seated (Max): 0.022" (0.55mm); Number of Terminations: 2; Failure Rate: -
U5 = SN65HVD1050DR: High-Speed CAN Transceiver with Silent Mode 8-SOIC -40 to 125; MF: Texas Instruments; Min Supply Voltage: 4.75V; Max Supply Voltage: 5.25V; Data Rate: 1Mbps; Number of Transceivers: 1; Operating Supply Voltage: 5V; Nominal Supply Current: 70mA; Purchase-URL: https://pricing.snapeda.com/search/part/SN65HVD1050DR/?ref=eda; Digi-Key_Part_Number: 296-26335-1-ND; MP: SN65HVD1050DR; Check_prices: https://www.snapeda.com/parts/SN65HVD1050DR/Texas%20Instruments/view-part/1043210/?ref=eda; SnapEDA_Link: https://www.snapeda.com/parts/SN65HVD1050DR/Texas%20Instruments/view-part/1043210/?ref=snap; Value: *; Package: SOIC-8 Texas Instruments; Supplier 1: Digi-Key; Manufacturer: Texas Instruments; Manufacturer Part Number: SN65HVD1050DR; RoHS: Yes; Category: Interface ICs; Pricing 1: 1=1,69000, 10=1,51300, 25=1,43640, 100=1,18000, 250=1,10304, 500=0,97478, 1000=0,84700 (USD); Case/Package: D; Number of Pins: 8; Weight: 0.002677oz; Contact Plating: Gold; Min Operating Temperature: -40°C; Max Operating Temperature: 125°C; Packaging: Tape and Reel; Package Quantity: 2500; Max Supply Current: 70mA; Number of Drivers: 1; Number of Receivers: 1; Series: -; Supply Current: 70mA; Number of Transmit Buffers: 1; Number of Receive Buffers: 1; Radiation Hardening: No; Lead Free: Lead Free; RoHS Compliant: Yes; REACH SVHC: No SVHC; ComponentLink1URL: https://datasheet.ciiva.com/26828/sn65hvd1050dr-26828644.pdf?src-supplier=IIIC; ComponentLink1Description: https://datasheet.ciiva.com/26828/sn65hvd1050dr-26828644.pdf?src-supplier=IIIC; ComponentLink2URL: https://datasheet.ciiva.com/46392/1888948-46392549.pdf?src-supplier=Element14; ComponentLink2Description: https://datasheet.ciiva.com/46392/1888948-46392549.pdf?src-supplier=Element14; ComponentLink3URL: https://datasheet.ciiva.com/1701/sn65hvd1050-1701693.pdf?src-supplier=Digi-Key; ComponentLink3Description: https://datasheet.ciiva.com/1701/sn65hvd1050-1701693.pdf?src-supplier=Digi-Key; ComponentLink4URL: https://datasheet.ciiva.com/1701/sn65hvd1050-1701694.pdf?src-supplier=Digi-Key; ComponentLink4Description: https://datasheet.ciiva.com/1701/sn65hvd1050-1701694.pdf?src-supplier=Digi-Key; ComponentLink5URL: https://datasheet.ciiva.com/1701/sn65hvd1050-1701695.pdf?src-supplier=Digi-Key; ComponentLink5Description: https://datasheet.ciiva.com/1701/sn65hvd1050-1701695.pdf?src-supplier=Digi-Key; Supplier Part Number 1: 296-26335-6-ND
U6 = NUP4202W1T2G: TVS DIODE 5VWM 14.5VC SOT363; Manufacturer: ON Semiconductor; Capacitance @ Frequency: 3pF @ 1MHz; Voltage - Reverse Standoff (Typ): 5V (Max); Voltage - Breakdown (Min): 6V; Power Line Protection: No; Current - Peak Pulse (10/1000µs): 28A (8/20µs); Power - Peak Pulse: 500W; Voltage - Clamping (Max) @ Ipp: 14.5V (Typ); Type: Steering (Rail to Rail); Operating Temperature: -40°C ~ 125°C (TJ); Supplier: Digi-Key; Applications: General Purpose; Manufacturer Part Number: NUP4202W1T2G; Packaging: Cut Tape (CT); Package / Case: 6-TSSOP, SC-88, SOT-363; Mounting Type: Surface Mount; RoHS: RoHS Compliant; Category: Circuit Protection; Supplier Device Package: SC-88/SC70-6/SOT-363; Part Status: Active; ComponentLink1URL: http://www.onsemi.com/pub_link/Collateral/NUP4202W1-D.PDF; ComponentLink1Description: http://www.onsemi.com/pub_link/Collateral/NUP4202W1-D.PDF; Pricing: 1=0.69, 10=0.595, 100=0.4441, 500=0.34896, 1000=0.26965 (USD); Stock: 8683; Supplier Part Number: NUP4202W1T2GOSCT-ND

## Sheet Com_Uart.SchDoc
size A3; CompanyName: Ok's Lab; Engineer: Oktay Topcu; SheetNumber: 5; SheetTotal: 7; UniqueID: 20200803; X1: Altium101.PrjPcb; X2: A3; X3: 20200803; X4: r1.0; X6: 5; X7: 7; X8: Com_Uart.SchDoc
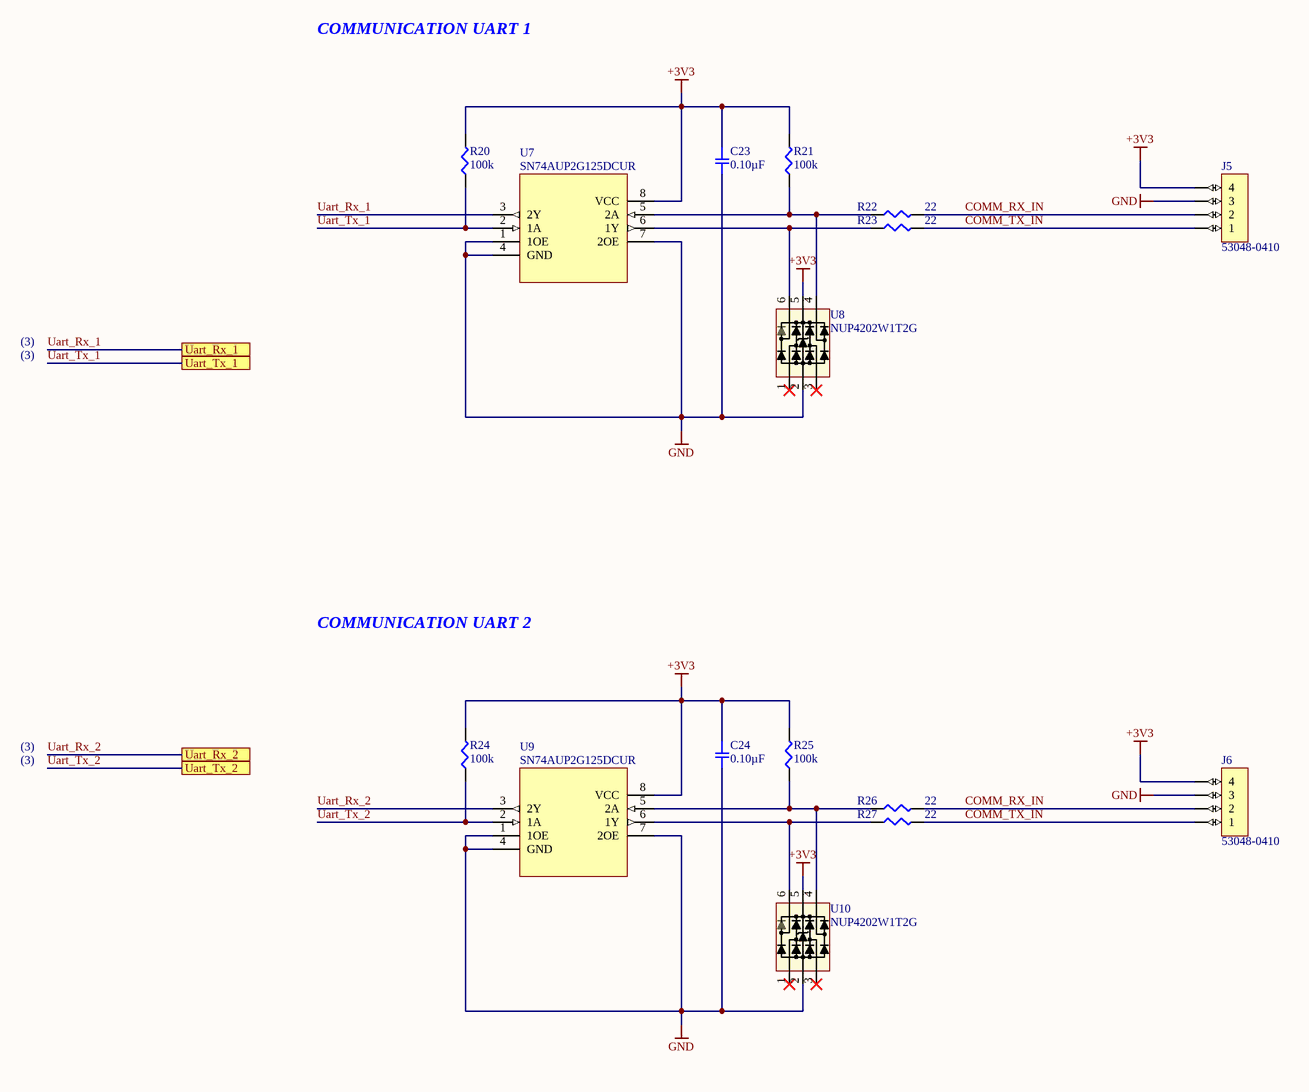
[diagram p3: Com_Uart.SchDoc]

### Parts
C23  0.10µF  [SMD-0603C]
C24  0.10µF  [SMD-0603C]
J5  53048-0410  [CONN_4_POS__0530480410]
J6  53048-0410  [CONN_4_POS__0530480410]
R20  100k  [SMD-0603-RES]
R21  100k  [SMD-0603-RES]
R22  22  [SMD-0603-RES]
R23  22  [SMD-0603-RES]
R24  100k  [SMD-0603-RES]
R25  100k  [SMD-0603-RES]
R26  22  [SMD-0603-RES]
R27  22  [SMD-0603-RES]
U7  SN74AUP2G125DCUR  [VFSOP_8]
U8  NUP4202W1T2G  [SOT-363]
U9  SN74AUP2G125DCUR  [VFSOP_8]
U10  NUP4202W1T2G  [SOT-363]

### Ports
Uart_Rx_1, Uart_Rx_2, Uart_Tx_1, Uart_Tx_2

### Nets
+3V3: C23.1 C24.1 J5.4 J6.4 R20.2 R21.2 R24.2 R25.2 U7.8(VCC) U8.5 U9.8(VCC) U10.5
GND: C23.2 C24.2 J5.3 J6.3 U7.1(1OE) U7.4(GND) U7.7(2OE) U8.2 U9.1(1OE) U9.4(GND) U9.7(2OE) U10.2
COMM_RX_IN: J5.2 J6.2 R22.2 R26.2
COMM_TX_IN: J5.1 J6.1 R23.2 R27.2
Uart_Rx_1: U7.3(2Y) ; port Uart_Rx_1
Uart_Rx_2: U9.3(2Y) ; port Uart_Rx_2
Uart_Tx_1: R20.1 U7.2(1A) ; port Uart_Tx_1
Uart_Tx_2: R24.1 U9.2(1A) ; port Uart_Tx_2
NetR21_1: R21.1 R22.1 U7.5(2A) U8.4
NetR23_1: R23.1 U7.6(1Y) U8.6
NetR25_1: R25.1 R26.1 U9.5(2A) U10.4
NetR27_1: R27.1 U9.6(1Y) U10.6

Not connected (* = marked no-connect by the designer): U8 1* 3*; U10 1* 3*

### Notes on the sheet
- COMMUNICATION UART 1
- (3)
- COMMUNICATION UART 2
- Title
- Size:
- Date:
- Number:
- Revision:
- Sheet
- of
- File:

### Library data of the parts
C23 C24 = GCJ188R71H104KA12D: as C11 on sheet MCU; Datasheets: http://www.murata.com/~/media/webrenewal/support/library/catalog/products/capacitor/mlcc/c03e.ashx; Image: //media.digikey.com/Renders/Murata%20Renders/0603%28LQG18%29.jpg; Digi-Key Part Number: 490-5798-1-ND; Quantity Available: 163695; @ qty: 0; Packaging: Cut Tape (CT); Series: GCJ; Part Status: Active; Value: 0.10µF; Voltage: 50V; Temperature Coefficient: X7R; Operating Temperature: -55°C ~ 125°C; Features: Soft Termination; Ratings: AEC-Q200; Applications: Automotive, Boardflex Sensitive; Mounting Type: Surface Mount, MLCC; Package / Case: 0603 (1608 Metric); Size / Dimension: 0.063" L x 0.031" W (1.60mm x 0.80mm); Height - Seated (Max): -; Thickness (Max): 0.035" (0.90mm); Lead Spacing: -; Lead Style: -; Manufacturer Part Number: GCJ188R71H104KA12D
J5 J6 = CONN_4_POS__0530480410: CONN HEADER R/A 4POS 1.25MM; Manufacturer: Molex; Contact Resistance: 20mR; Current Rating: 1A; Voltage Rating: 125V; Number of Positions: 4; Insulation Resistance: 100MR; Gender: Male; Connector Type: Blade Pin; Glow Wire Compliant: Non-compliant; Supplier 1: Avnet; Manufacturer Part Number: 53048-0410; Stock 1: 44; Pricing 1: 1=0.1232 (USD); Mount: Through Hole; Case/Package: 0410; Contact Material: Bronze,Tin; Contact Plating: Tin; Color: Natural; Housing Color: Natural; Housing Material: Nylon; Min Operating Temperature: -40°C; Max Operating Temperature: 85°C; Package Quantity: 5000; Number of Rows: 1; Packaging: Tray; Contact Gender: Male; Termination: Solder; Number of Contacts: 4; Orientation: Right Angle; Number of Circuits: 4; Voltage Rating (DC): 125V; Series: PicoBlade; Contact Type: Blade Pin; Pitch: 1.25mm; Depth: 5.5mm; Radiation Hardening: No; REACH SVHC: Unknown; Lead Free: Lead Free; Flammability Rating: UL94 V-0; RoHS Compliant: Yes; ComponentLink1URL: https://www.distrelec.biz/Web/Downloads/60/_e/gg116847-116860_e.pdf?mime=application%2Fpdf&src-supplier=Distrelec; ComponentLink1Description: https://www.distrelec.biz/Web/Downloads/60/_e/gg116847-116860_e.pdf?mime=application%2Fpdf&src-supplier=Distrelec; ComponentLink2URL: http://uk.rs-online.com/webdocs/1362/0900766b81362ba7.pdf?src-supplier=RSComponents; ComponentLink2Description: http://uk.rs-online.com/webdocs/1362/0900766b81362ba7.pdf?src-supplier=RSComponents; ComponentLink3URL: http://www.molex.com/webdocs/datasheets/pdf/en-us/0530480410_PCB_HEADERS.pdf?src-supplier=Avnet; ComponentLink3Description: http://www.molex.com/webdocs/datasheets/pdf/en-us/0530480410_PCB_HEADERS.pdf?src-supplier=Avnet; ComponentLink4URL: http://www.mouser.com/ds/2/276/0530480410_PCB_HEADERS-170930.pdf?src-supplier=Mouser; ComponentLink4Description: http://www.mouser.com/ds/2/276/0530480410_PCB_HEADERS-170930.pdf?src-supplier=Mouser; Supplier Part Number 1: 53048-0410
R20 R21 R24 R25 = ERJ-3EKF1003V: RES SMD 100K OHM 1% 1/10W 0603; Manufacturer: Panasonic Electronic Components; Factory Stock: 0; Unit Price (USD): 0.00379; @ qty: 1500; Minimum Quantity: 1; Power (Watts): 0.1W, 1/10W; Temperature Coefficient: ±100ppm/°C; Part Number: ERJ-3EKF1003V; Datasheets: http://industrial.panasonic.com/www-cgi/jvcr13pz.cgi?E+PZ+3+AOA0002+ERJ3EKF1003V+7+WW; Image: //media.digikey.com/Photos/Panasonic%20Photos/MFG_ERJ-P6W%20Series.jpg; Digi-Key Part Number: P100KHCT-ND; Quantity Available: 2179804; Packaging: Cut Tape (CT); Series: ERJ; Part Status: Active; Value: 100k; Tolerance: ±1%; Composition: Thick Film; Features: Automotive AEC-Q200; Operating Temperature: -55°C ~ 155°C; Package / Case: 0603 (1608 Metric); Supplier Device Package: 0603; Size / Dimension: 0.063" L x 0.031" W (1.60mm x 0.80mm); Height - Seated (Max): 0.022" (0.55mm); Number of Terminations: 2; Failure Rate: -
R22 R23 R26 R27 = ERJ-3EKF22R0V: as R11 on sheet MCU; Part Number: ERJ-3EKF22R0V; Datasheets: http://industrial.panasonic.com/www-cgi/jvcr13pz.cgi?E+PZ+3+AOA0002+ERJ3EKF22R0V+7+WW; Image: //media.digikey.com/Photos/Panasonic%20Photos/MFG_ERJ-P6W%20Series.jpg; Digi-Key Part Number: P22.0HCT-ND; Quantity Available: 100321; Packaging: Cut Tape (CT); Series: ERJ; Part Status: Active; Value: 22; Tolerance: ±1%; Composition: Thick Film; Features: Automotive AEC-Q200; Operating Temperature: -55°C ~ 155°C; Package / Case: 0603 (1608 Metric); Supplier Device Package: 0603; Size / Dimension: 0.063" L x 0.031" W (1.60mm x 0.80mm); Height - Seated (Max): 0.022" (0.55mm); Number of Terminations: 2; Failure Rate: -
U7 U9 = SN74AUP2G125DCUR: Low-Power Dual Bus Buffer Gate With 3-State Outputs 8-VSSOP -40 to 85; Manufacturer: Texas Instruments; Max Supply Voltage: 3.6V; Min Supply Voltage: 800mV; Propagation Delay: 6.5ns; Number of Elements: 2; Logic Function: Buffer,Inverting; Low Level Output Current: 4mA; Number of Input Lines: 4; Polarity: Non-Inverting; Number of Bits per Element: 1; High Level Output Current: -4mA; Quiescent Current: 500nA; Supplier 1: Avnet; Manufacturer Part Number: SN74AUP2G125DCUR; Stock 1: 0; Mount: Surface Mount; Case/Package: VSSOP; Number of Pins: 8; Min Operating Temperature: -40°C; Max Operating Temperature: 85°C; Package Quantity: 3000; Packaging: Tape and Reel; Number of Channels: 2; Number of Inputs: 2; Number of Outputs: 2; Number of Output Lines: 4; Number of Bits: 2; Output Type: 3-STATE; Series: 74AUP; Technology: CMOS; Lead Free: Lead Free; RoHS Compliant: Yes; ComponentLink1URL: http://www.ti.com/lit/ds/symlink/sn74aup2g125.pdf?src-supplier=Digi-Key; ComponentLink1Description: http://www.ti.com/lit/ds/symlink/sn74aup2g125.pdf?src-supplier=Digi-Key; ComponentLink2URL: http://www.ti.com/general/docs/lit/getliterature.tsp?genericPartNumber=SN74AUP2G125&&fileType=pdf&src-supplier=Avnet; ComponentLink2Description: http://www.ti.com/general/docs/lit/getliterature.tsp?genericPartNumber=SN74AUP2G125&&fileType=pdf&src-supplier=Avnet; Supplier Part Number 1: SN74AUP2G125DCUR
U8 U10 = NUP4202W1T2G: as U6 on sheet Com_Canbus; Type: Steering (Rail to Rail); Operating Temperature: -40°C ~ 125°C (TJ); Supplier: Digi-Key; Applications: General Purpose; Manufacturer Part Number: NUP4202W1T2G; Packaging: Cut Tape (CT); Package / Case: 6-TSSOP, SC-88, SOT-363; Mounting Type: Surface Mount; RoHS: RoHS Compliant; Category: Circuit Protection; Supplier Device Package: SC-88/SC70-6/SOT-363; Part Status: Active; ComponentLink1URL: http://www.onsemi.com/pub_link/Collateral/NUP4202W1-D.PDF; ComponentLink1Description: http://www.onsemi.com/pub_link/Collateral/NUP4202W1-D.PDF; Pricing: 1=0.69, 10=0.595, 100=0.4441, 500=0.34896, 1000=0.26965 (USD); Stock: 8683; Supplier Part Number: NUP4202W1T2GOSCT-ND

## Sheet Relay.SchDoc
size A3; CompanyName: Ok's Lab; Engineer: Oktay Topcu; SheetNumber: 7; SheetTotal: 7; UniqueID: 20200803; X1: Altium101.PrjPcb; X2: A3; X3: 20200803; X4: r1.0; X6: 7; X7: 7; X8: Relay.SchDoc
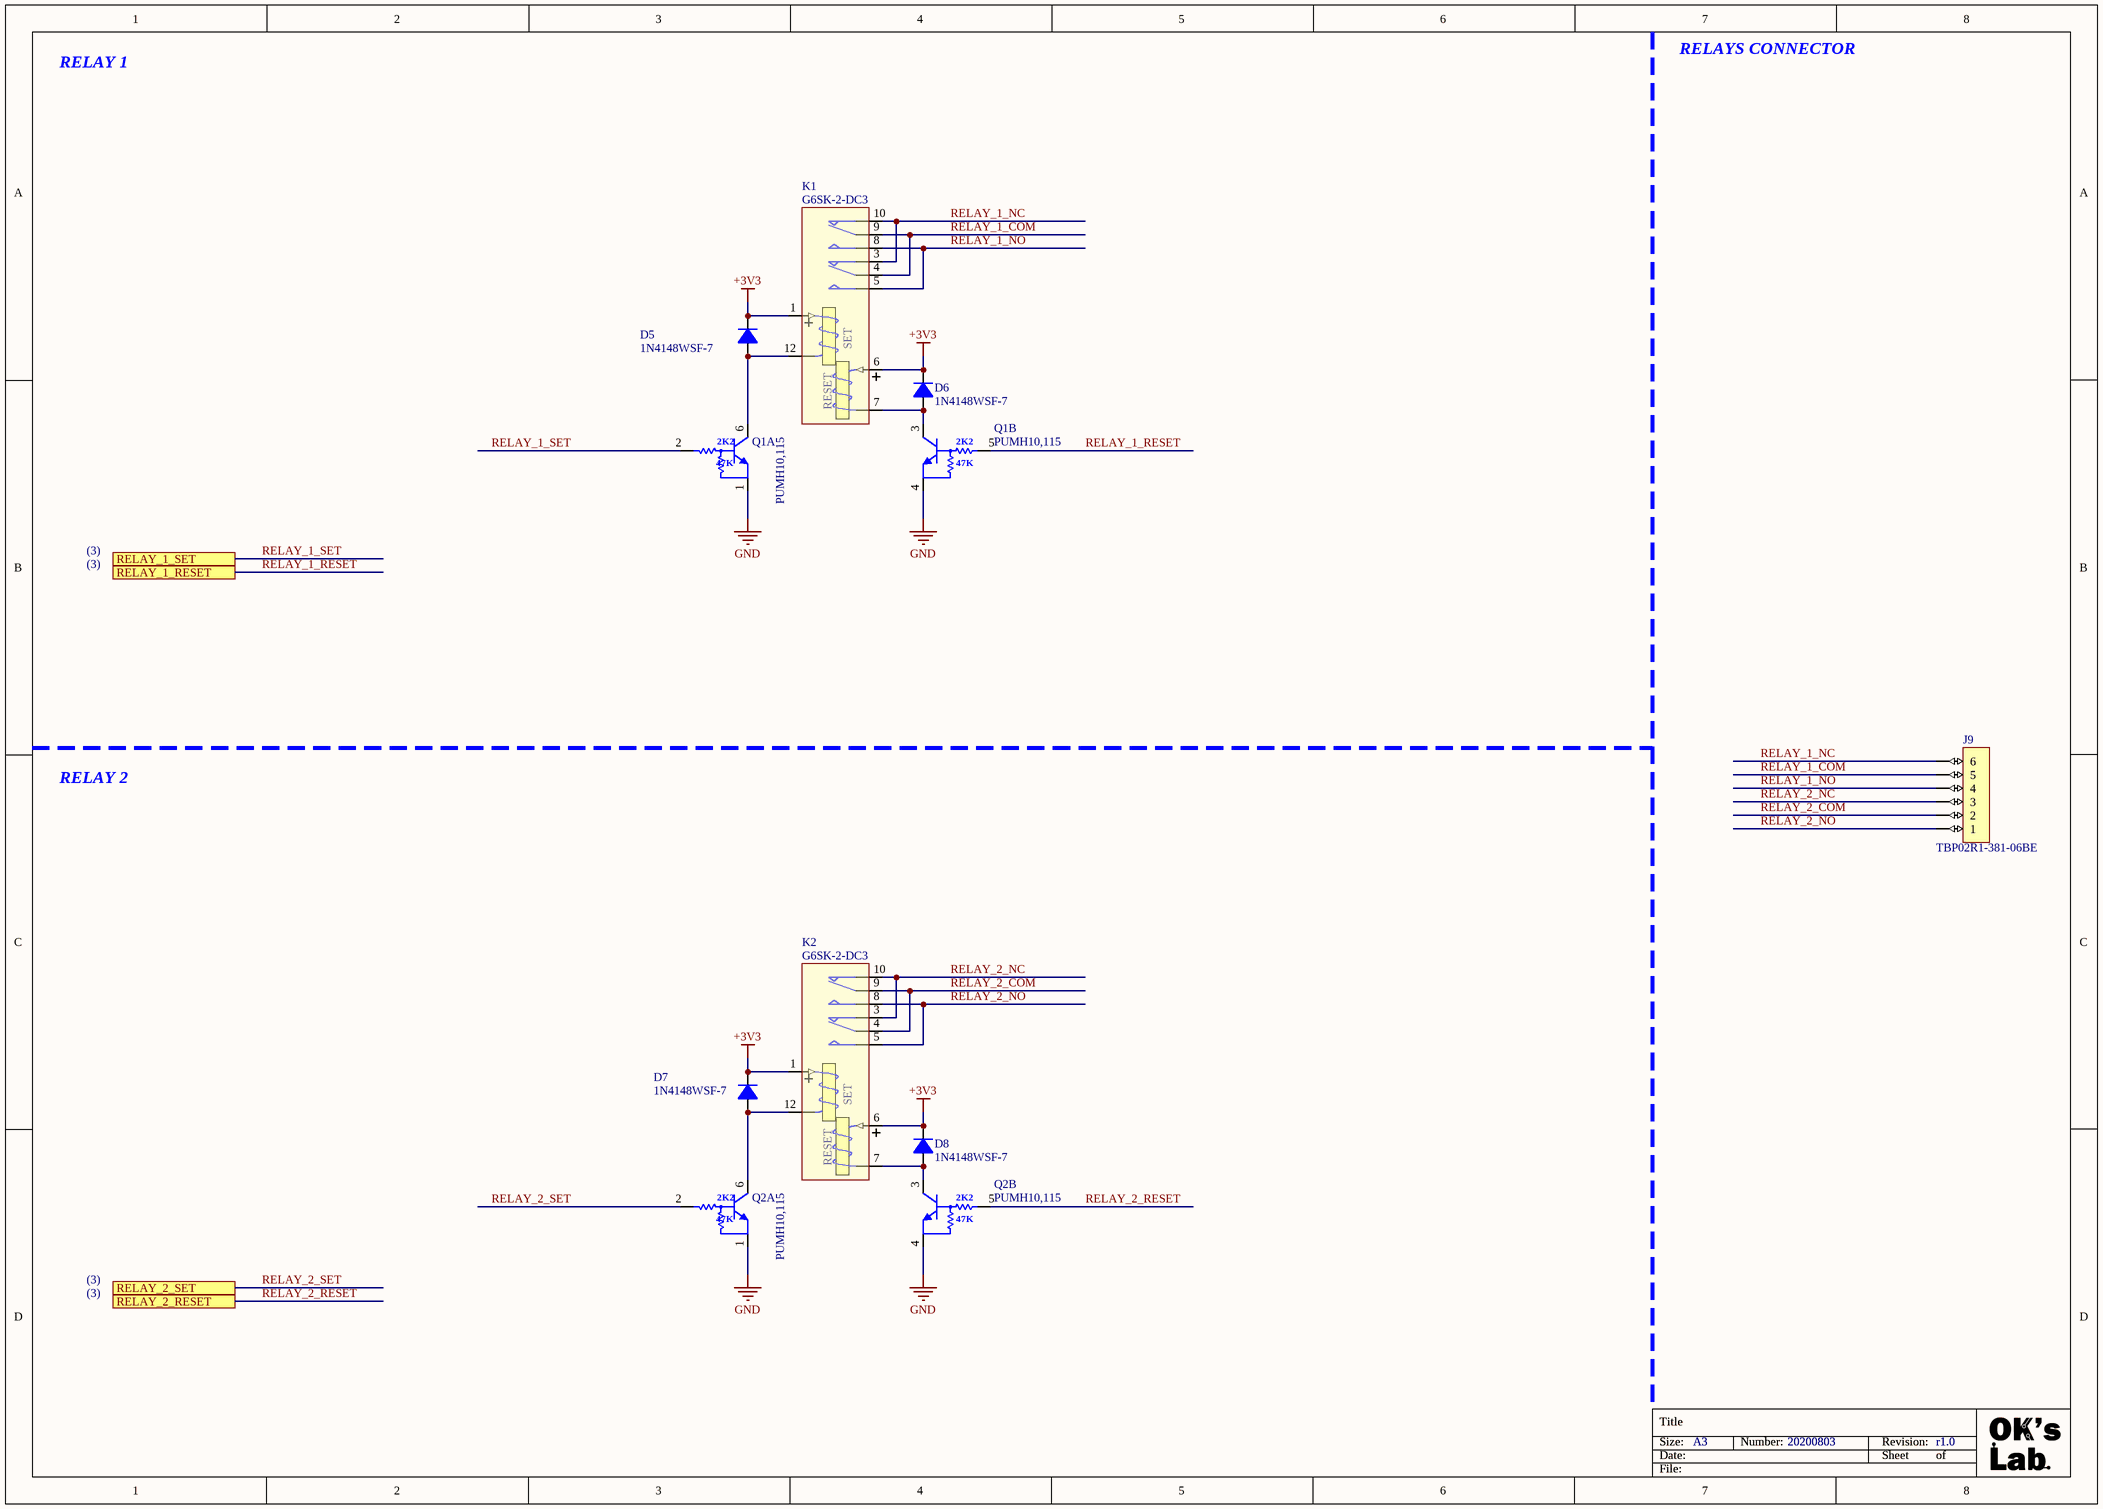
[diagram p4: Relay.SchDoc]

### Parts
D5  1N4148WSF-7  [SOD323F__SC90]
D6  1N4148WSF-7  [SOD323F__SC90]
D7  1N4148WSF-7  [SOD323F__SC90]
D8  1N4148WSF-7  [SOD323F__SC90]
J9  TBP02R1-381-06BE  [CONN_6_POS__TBP02R1-381-06BE]
K1  G6SK-2-DC3  [G6SK-2]
K2  G6SK-2-DC3  [G6SK-2]
Q1  PUMH10,115  [SOT-363]  (parts A,B of 2)
Q2  PUMH10,115  [SOT-363]  (parts A,B of 2)

### Ports
RELAY_1_RESET, RELAY_1_SET, RELAY_2_RESET, RELAY_2_SET

### Nets
+3V3: D5.2(K) D6.2(K) D7.2(K) D8.2(K) K1.1(T1) K1.6(T1) K2.1(T1) K2.6(T1)
GND: Q1.1(E1) Q1.4(E2) Q2.1(E1) Q2.4(E2)
RELAY_1_COM: J9.5 K1.4(COM_1) K1.9(COM_2)
RELAY_1_NC: J9.6 K1.3(NC_1) K1.10(NC_2)
RELAY_1_NO: J9.4 K1.5(NO_1) K1.8(NO_2)
RELAY_1_RESET: Q1.5(B2) ; port RELAY_1_RESET
RELAY_1_SET: Q1.2(B1) ; port RELAY_1_SET
RELAY_2_COM: J9.2 K2.4(COM_1) K2.9(COM_2)
RELAY_2_NC: J9.3 K2.3(NC_1) K2.10(NC_2)
RELAY_2_NO: J9.1 K2.5(NO_1) K2.8(NO_2)
RELAY_2_RESET: Q2.5(B2) ; port RELAY_2_RESET
RELAY_2_SET: Q2.2(B1) ; port RELAY_2_SET
NetD5_1: D5.1(A) K1.12(T2) Q1.6(C1)
NetD6_1: D6.1(A) K1.7(T2) Q1.3(C2)
NetD7_1: D7.1(A) K2.12(T2) Q2.6(C1)
NetD8_1: D8.1(A) K2.7(T2) Q2.3(C2)

### Notes on the sheet
- RELAY 1
- RELAYS CONNECTOR
- (3)
- RELAY 2
- Title
- Size:
- Date:
- Number:
- Revision:
- Sheet
- of
- File:
- (in symbol PUMH10,115, part A) 2K2; 47K
- (in symbol PUMH10,115, part B) 2K2; 47K
- (in symbol RELAY__G6SK-2 DC3) SET; RESET

### Library data of the parts
D5-D8 = DIODE_1N4148WSF-7: DIODE GEN PURP 100V 250MA SOD323; Manufacturer: Diodes; Reverse Recovery Time: 4ns; Peak Non-Repetitive Surge Current: 4A; Element Configuration: Single; Supplier 1: Avnet; Manufacturer Part Number: 1N4148WSF-7; Stock 1: 0; Pricing 1: 3000=0.0321, 6000=0.0289, 12000=0.0289, 18000=0.0251, 24000=0.0251, 30000=0.0225, 300000=0.02 (USD); Mount: Surface Mount; Case/Package: SOD; Number of Pins: 2; Contact Plating: Tin,Matte; Min Operating Temperature: -55°C; Max Operating Temperature: 150°C; Package Quantity: 3000; Packaging: Tape and Reel; Forward Current: 250mA; Average Rectified Current: 250mA; Max Repetitive Reverse Voltage (Vrrm): 100V; Max Reverse Voltage (DC): 100V; Lead Free: Lead Free; RoHS Compliant: Yes; Supplier Part Number 1: 1N4148WSF-7
J9 = CONN_6_POS__TBP02R1-381-06BE: TERMINAL BLOCK, PLUGGABLE, 3.81,; Manufacturer: CUI Devices; Product Status: New Product; Supplier 1: Mouser; Manufacturer Part Number: TBP02R1-381-06BE; RoHS: RoHS Compliant; Category: Pluggable Terminal Blocks; Stock 1: 0; Pricing 1: 1=0.00 (AUD); Minimum Order Quantity: 1; Reeling: False
K1 K2 = RELAY__G6SK-2 DC3: Telecom Relay DPDT (2 Form C) Through Hole; Manufacturer: Omron; Contact Current Rating: 2A; Coil Current: 66.7mA; Operate Time: 4ms; Coil Power: 200mW; Coil Resistance: 45R; Coil Type: Latching, Dual Coil; Coil Voltage (DC): 3V; Max Voltage Rating (AC): 250V; Max Voltage Rating (DC): 220V; Supplier 1: Avnet; Manufacturer Part Number: G6SK-2-DC3; Stock 1: 0; Pricing 1: 1000=2.6926, 2000=2.6078, 4000=2.4853, 6000=2.4153, 8000=2.3278, 10000=2.2578, 100000=2.1878 (USD); Mount: Through Hole; Case/Package: DIP; Number of Pins: 8; Contact Material: Gold,Silver; Weight: 2g; Min Operating Temperature: -40°C; Max Operating Temperature: 70°C; Package Quantity: 50; Packaging: Rail/Tube; Termination: PC Pin; Throw Configuration: DPDT; Release Time: 4ms; Relay Type: Telecom; Max Current Rating: 2A; Power Consumption: 200mW; Series: G6S; Radiation Hardening: No; ComponentLink1URL: http://www.components.omron.com/components/web/PDFLIB.nsf/0/3AB780E03885359085257201007DD68A/$file/G6S_1012.pdf?src-supplier=Mouser; ComponentLink1Description: http://www.components.omron.com/components/web/PDFLIB.nsf/0/3AB780E03885359085257201007DD68A/$file/G6S_1012.pdf?src-supplier=Mouser; ComponentLink2URL: http://www.components.omron.com/components/web/PDFLIB.nsf/0/3AB780E03885359085257201007DD68A/$file/G6S_0514.pdf?src-supplier=Digi-Key; ComponentLink2Description: http://www.components.omron.com/components/web/PDFLIB.nsf/0/3AB780E03885359085257201007DD68A/$file/G6S_0514.pdf?src-supplier=Digi-Key; Supplier Part Number 1: G6SK2DC3BYOMZ
Q1 Q2 = PUMH10,115: TRANS 2NPN PREBIAS 0.3W 6TSSOP; Manufacturer: Nexperia USA Inc.; Transistor Type: 2 NPN - Pre-Biased (Dual); Resistor - Emitter Base (R2) (Ohms): 47k; Vce Saturation (Max) @ Ib, Ic: 100mV @ 250µA, 5mA; DC Current Gain (hFE) (Min) @ Ic, Vce: 100 @ 10mA, 5V; Voltage - Collector Emitter Breakdown (Max): 50V; Current - Collector (Ic) (Max): 100mA; Resistor - Base (R1) (Ohms): 2.2k; Power - Max: 300mW; Current - Collector Cutoff (Max): 1µA; Package / Case: 6-TSSOP, SC-88, SOT-363; Supplier Device Package: 6-TSSOP; Manufacturer Part Number: PUMH10,115; Category: Discrete Semiconductor Products; Mounting Type: Surface Mount; Part Status: Active; RoHS: RoHS Compliant; Supplier: Digi-Key; Packaging: Cut Tape (CT); Frequency - Transition: -; ComponentLink1URL: http://assets.nexperia.com/documents/data-sheet/PEMH10_PUMH10.pdf; ComponentLink1Description: http://assets.nexperia.com/documents/data-sheet/PEMH10_PUMH10.pdf; Supplier Part Number: 1727-5235-1-ND